# Altium project Xetucanbang.PrjPcb
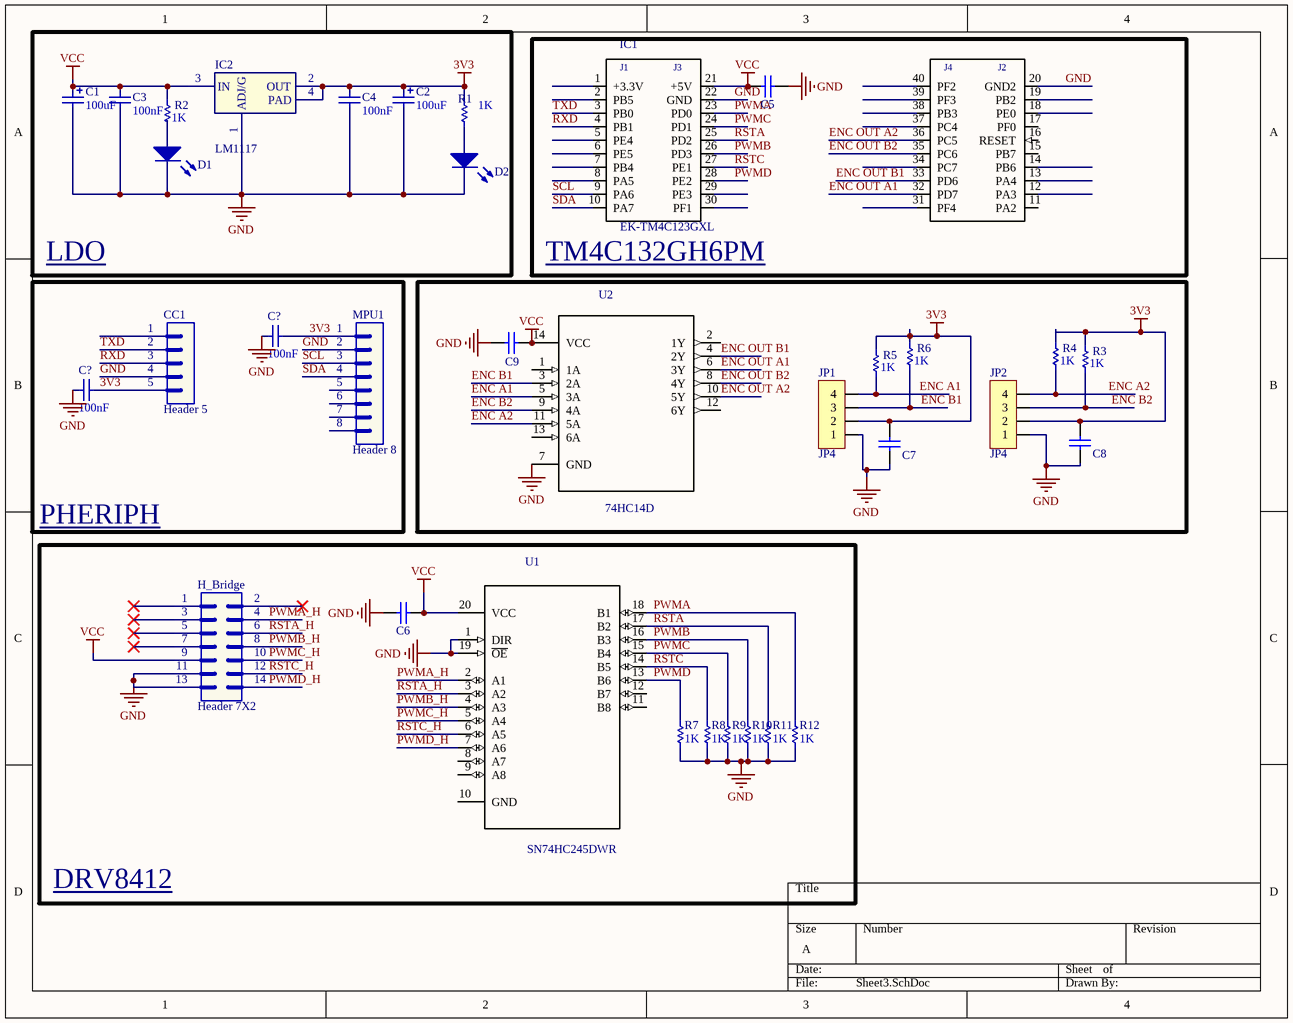
[diagram p0: Sheet3.SchDoc]
1 sheet, 34 parts. Net scope: global (net labels, ports and power ports of the same name join across sheets).
Board file: Version2AutoBanlancingRobot.PcbDoc

## Sheet Sheet3.SchDoc
size A

### Parts
(Parts that share a designator on the sheet are numbered #1, #2 ... from top to bottom, then left to right.)
C1  value 100uF  [CAP ALU SIZE C]  (hidden comment: Cap Pol SMD)
C2  value 100uF  [CAP ALU SIZE C]  (hidden comment: Cap Pol SMD)
C3  value 100nF  [CAP-SM-0805]  (hidden comment: Cap Non-Pol SMD)
C4  value 100nF  [CAP-SM-0805]  (hidden comment: Cap Non-Pol SMD)
C5  Cap Non-Pol SMD  [CAP-SM-0805]  (value not drawn)
C6  Cap Non-Pol SMD  [CAP-SM-0805]  (value not drawn)
C7  Cap Non-Pol SMD  [CAP-SM-0805]  (value not drawn)
C8  Cap Non-Pol SMD  [CAP-SM-0805]  (value not drawn)
C9  Cap Non-Pol SMD  [CAP-SM-0805]  (value not drawn)
C?#1  value 100nF  [CAP-SM-0805]  (hidden comment: Cap Non-Pol SMD)
C?#2  value 100nF  [CAP-SM-0805]  (hidden comment: Cap Non-Pol SMD)
CC1  Header 5  [JP5]
D1  LED SMD  [LED_0603_Blue]  (value not drawn)
D2  LED SMD  [LED_0603_Blue]  (value not drawn)
H_Bridge  Header 7X2  [JP7X2]
IC1  EK-TM4C123GXL  [TM4C123LAUNCHPAD]
IC2  LM1117  [SOT223-4N]
JP1  JP4  [JP4-C1T]
JP2  JP4  [JP4-C1T]
MPU1  Header 8  [JP8]
R1  value 1K  [RES-SM-0805]  (hidden comment: Res SMD)
R2  value 1K  [RES-SM-0805]  (hidden comment: Res SMD)
R3  value 1K  [RES-SM-0805]  (hidden comment: Res SMD)
R4  value 1K  [RES-SM-0805]  (hidden comment: Res SMD)
R5  value 1K  [RES-SM-0805]  (hidden comment: Res SMD)
R6  value 1K  [RES-SM-0805]  (hidden comment: Res SMD)
R7  value 1K  [RES-SM-0805]  (hidden comment: Res SMD)
R8  value 1K  [RES-SM-0805]  (hidden comment: Res SMD)
R9  value 1K  [RES-SM-0805]  (hidden comment: Res SMD)
R10  value 1K  [RES-SM-0805]  (hidden comment: Res SMD)
R11  value 1K  [RES-SM-0805]  (hidden comment: Res SMD)
R12  value 1K  [RES-SM-0805]  (hidden comment: Res SMD)
U1  SN74HC245DWR  [SOIC127P1030X265-20N]
U2  74HC14D  [SOIC127P600X175-14N]

### Blocks framed on the sheet
LDO: C1-C4 D1 D2 IC2 R1 R2
TM4C132GH6PM: C5 IC1

### Nets
3V3: C2.1 C4.2 C7.2 C8.2 C?#1.1 C?#2.1 CC1.5 IC2.2(OUT) IC2.4(PAD) JP1.2 JP2.2 MPU1.1 R1.2 R3.2 R4.2 R5.2 R6.2
GND: C1.2 C2.2 C3.1 C4.1 C5.2 C6.2 C7.1 C8.1 C9.2 C?#1.2 C?#2.2 CC1.4 D1.2(K) D2.2(K) H_Bridge.11 H_Bridge.13 IC1.20(GND2) IC1.22(GND) IC2.1(ADJ/G) JP1.1 JP2.1 MPU1.2 R7.1 R8.1 R9.1 R10.1 R11.1 R12.1 U1.1(DIR) U1.19(~{OE}) U2.7(GND)
VCC: C1.1 C3.2 C5.1 C6.1 C9.1 H_Bridge.9 IC1.21(+5V) IC2.3(IN) R2.2 U1.20(VCC) U2.14(VCC)
ENC A1: JP1.4 R5.1 U2.5(3A)
ENC A2: JP2.4 R4.1 U2.11(5A)
ENC B1: JP1.3 R6.1 U2.3(2A)
ENC B2: JP2.3 R3.1 U2.9(4A)
ENC OUT A1: IC1.32(PD7) U2.6(3Y)
ENC OUT A2: IC1.36(PC5) U2.10(5Y)
ENC OUT B1: IC1.33(PD6) U2.4(2Y)
ENC OUT B2: IC1.35(PC6) U2.8(4Y)
PWMA: IC1.23(PD0) R12.2 U1.18(B1)
PWMA_H: H_Bridge.4 U1.2(A1)
PWMB: IC1.26(PD3) R10.2 U1.16(B3)
PWMB_H: H_Bridge.8 U1.4(A3)
PWMC: IC1.24(PD1) R9.2 U1.15(B4)
PWMC_H: H_Bridge.10 U1.5(A4)
PWMD: IC1.28(PE2) R7.2 U1.13(B6)
PWMD_H: H_Bridge.14 U1.7(A6)
RSTA: IC1.25(PD2) R11.2 U1.17(B2)
RSTA_H: H_Bridge.6 U1.3(A2)
RSTC: IC1.27(PE1) R8.2 U1.14(B5)
RSTC_H: H_Bridge.12 U1.6(A5)
RXD: CC1.3 IC1.4(PB1)
SCL: IC1.9(PA6) MPU1.3
SDA: IC1.10(PA7) MPU1.4
TXD: CC1.2 IC1.3(PB0)
NetD1_1: D1.1(A) R2.1
NetD2_1: D2.1(A) R1.1

Not connected (* = marked no-connect by the designer): CC1 1; H_Bridge 1* 2* 3* 5* 7*; IC1 1(+3.3V) 2(PB5) 5(PE4) 6(PE5) 7(PB4) 8(PA5) 11(PA2) 12(PA3) 13(PA4) 14(PB6) 15(PB7) 16(RESET) 17(PF0) 18(PE0) 19(PB2) 29(PE3) 30(PF1) 31(PF4) 34(PC7) 37(PC4) 38(PB3) 39(PF3) 40(PF2); MPU1 5 6 7 8; U1 8(A7) 9(A8) 10(GND) 11(B8) 12(B7); U2 1(1A) 2(1Y) 12(6Y) 13(6A)

### Notes on the sheet
- PHERIPH <t>
- DRV8412 <t>
- (in symbol EK-TM4C123GXL) J1; J3; J4; J2

### Library data of the parts
C1 C2 = Cap Pol SMD: Polarized Capacitor (Radial)
C3-C9 C?#1 C?#2 = Cap Non-Pol SMD: Capacitor
CC1 = Header 5: Header, 5-Pin; LatestRevisionDate: 17-Jul-2002; LatestRevisionNote: Re-released for DXP Platform.; Publisher: Altium Limited
D1 D2 = LED SMD: LED
H_Bridge = Header 7X2: Header, 7-Pin, Dual row; LatestRevisionDate: 17-Jul-2002; LatestRevisionNote: Re-released for DXP Platform.; Publisher: Altium Limited
IC1 = EK-TM4C123GXL: Evaluation Kit For ARM Cortex-M4F-based Microcontrollers; MF: Texas Instruments; Price: 22.22 USD; Availability: Good; SnapEDA_Link: https://www.snapeda.com/parts/EK-TM4C123GXL/Texas%2520Instruments/view-part/?ref=snap; Package: None; MP: EK-TM4C123GXL; Value: *
IC2 = LM1117: Available in 1.8V, 2.5V, 2.85V, 3.3V, 5V, and  Adjustable Versions; Value: LM317
JP1 JP2 = JP4: WR-PHD 2.54 mm Angled Socket Header; Manufacturer: W¨¹rth Elektronik eiSos GmbH; partNo: 613004143121; ComponentLink1 Description: Manufacturer; ComponentLink2 Description: Datasheet; NoPins: 04; Created Date: 29 March 2013; ComponentLink1URL: http://www.we-online.com; ComponentLink2URL: http://katalog.we-online.de/em/datasheet/6130xx143121.pdf; Created by: Karrer Zheng
MPU1 = Header 8: Header, 8-Pin; LatestRevisionDate: 17-Jul-2002; LatestRevisionNote: Re-released for DXP Platform.; Publisher: Altium Limited
R1-R12 = Res SMD: Resistor
U1 = SN74HC245DWR: Logic IC - Receiver, transceiver Texas Instruments SN74HC245DWR SOIC 20; Price: None; MF: Texas Instruments; SnapEDA_Link: https://www.snapeda.com/parts/SN74HC245DWR/Texas%20Instruments/view-part/?ref=snap; Availability: Unavailable; MP: SN74HC245DWR; Package: SOIC-20 Texas Instruments; Value: *
U2 = 74HC14D: 74HC CMOS logic IC series SOIC14 Hex Schmitt Inverter; MF: Toshiba Semiconductor; Price: None; SnapEDA_Link: https://www.snapeda.com/parts/74HC14D/Toshiba%20Semiconductor%20and%20Storage/view-part/?ref=snap; Availability: Unavailable; MP: 74HC14D; Package: SOIC-14 Toshiba; Value: *